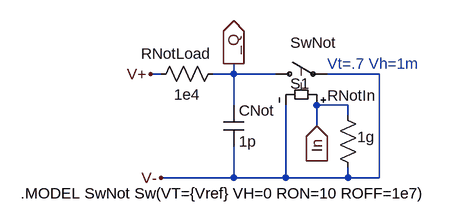
[diagram p0: schematic NotH.asc]
NotH.asc, the LTspice schematic file:
Version 4
SHEET 1 880 680
WIRE 16 192 0 192
WIRE 128 192 96 192
WIRE 128 192 128 176
WIRE 128 240 128 192
WIRE 128 352 16 352
WIRE 128 352 128 304
WIRE 192 192 128 192
WIRE 208 352 128 352
WIRE 208 352 208 240
WIRE 256 272 256 240
WIRE 304 240 256 240
WIRE 304 256 304 240
WIRE 304 352 208 352
WIRE 304 352 304 336
WIRE 352 192 272 192
WIRE 352 352 304 352
WIRE 352 352 352 192
FLAG 128 176 _Q
IOPIN 128 176 Out
FLAG 256 272 In
IOPIN 256 272 In
FLAG 16 352 V-
FLAG 0 192 V+
SYMBOL sw 176 192 R270
WINDOW 0 -15 39 VRight 0
WINDOW 3 48 39 VRight 0
SYMATTR InstName S1
SYMATTR Value SwNot
SYMBOL res 288 240 R0
WINDOW 0 -16 -15 Left 0
WINDOW 3 30 49 Left 0
SYMATTR InstName RNotIn
SYMATTR Value 1g
SYMBOL cap 112 240 R0
SYMATTR InstName CNot
SYMATTR Value 1p
SYMBOL res 112 176 R90
WINDOW 0 0 72 VBottom 0
WINDOW 3 32 56 VTop 0
SYMATTR InstName RNotLoad
SYMATTR Value 1e4
TEXT -200 376 Left 0 !.MODEL SwNot Sw(VT={Vref} VH=0 RON=10 ROFF=1e7)
TEXT 272 176 Left 0 ;Vt=.7 Vh=1m

The netlist it stands for:
* NotH.asc
S1 _Q V- In V- SwNot
RNotIn In V- 1g
CNot _Q V- 1p
RNotLoad _Q V+ 1e4
.MODEL SwNot Sw(VT={Vref} VH=0 RON=10 ROFF=1e7)
* Vt=.7 Vh=1m
.backanno
.end